# Altium schematic sheet Power_Sergeant.SchDoc
size Tabloid; SheetNumber: 3; SheetTotal: 6
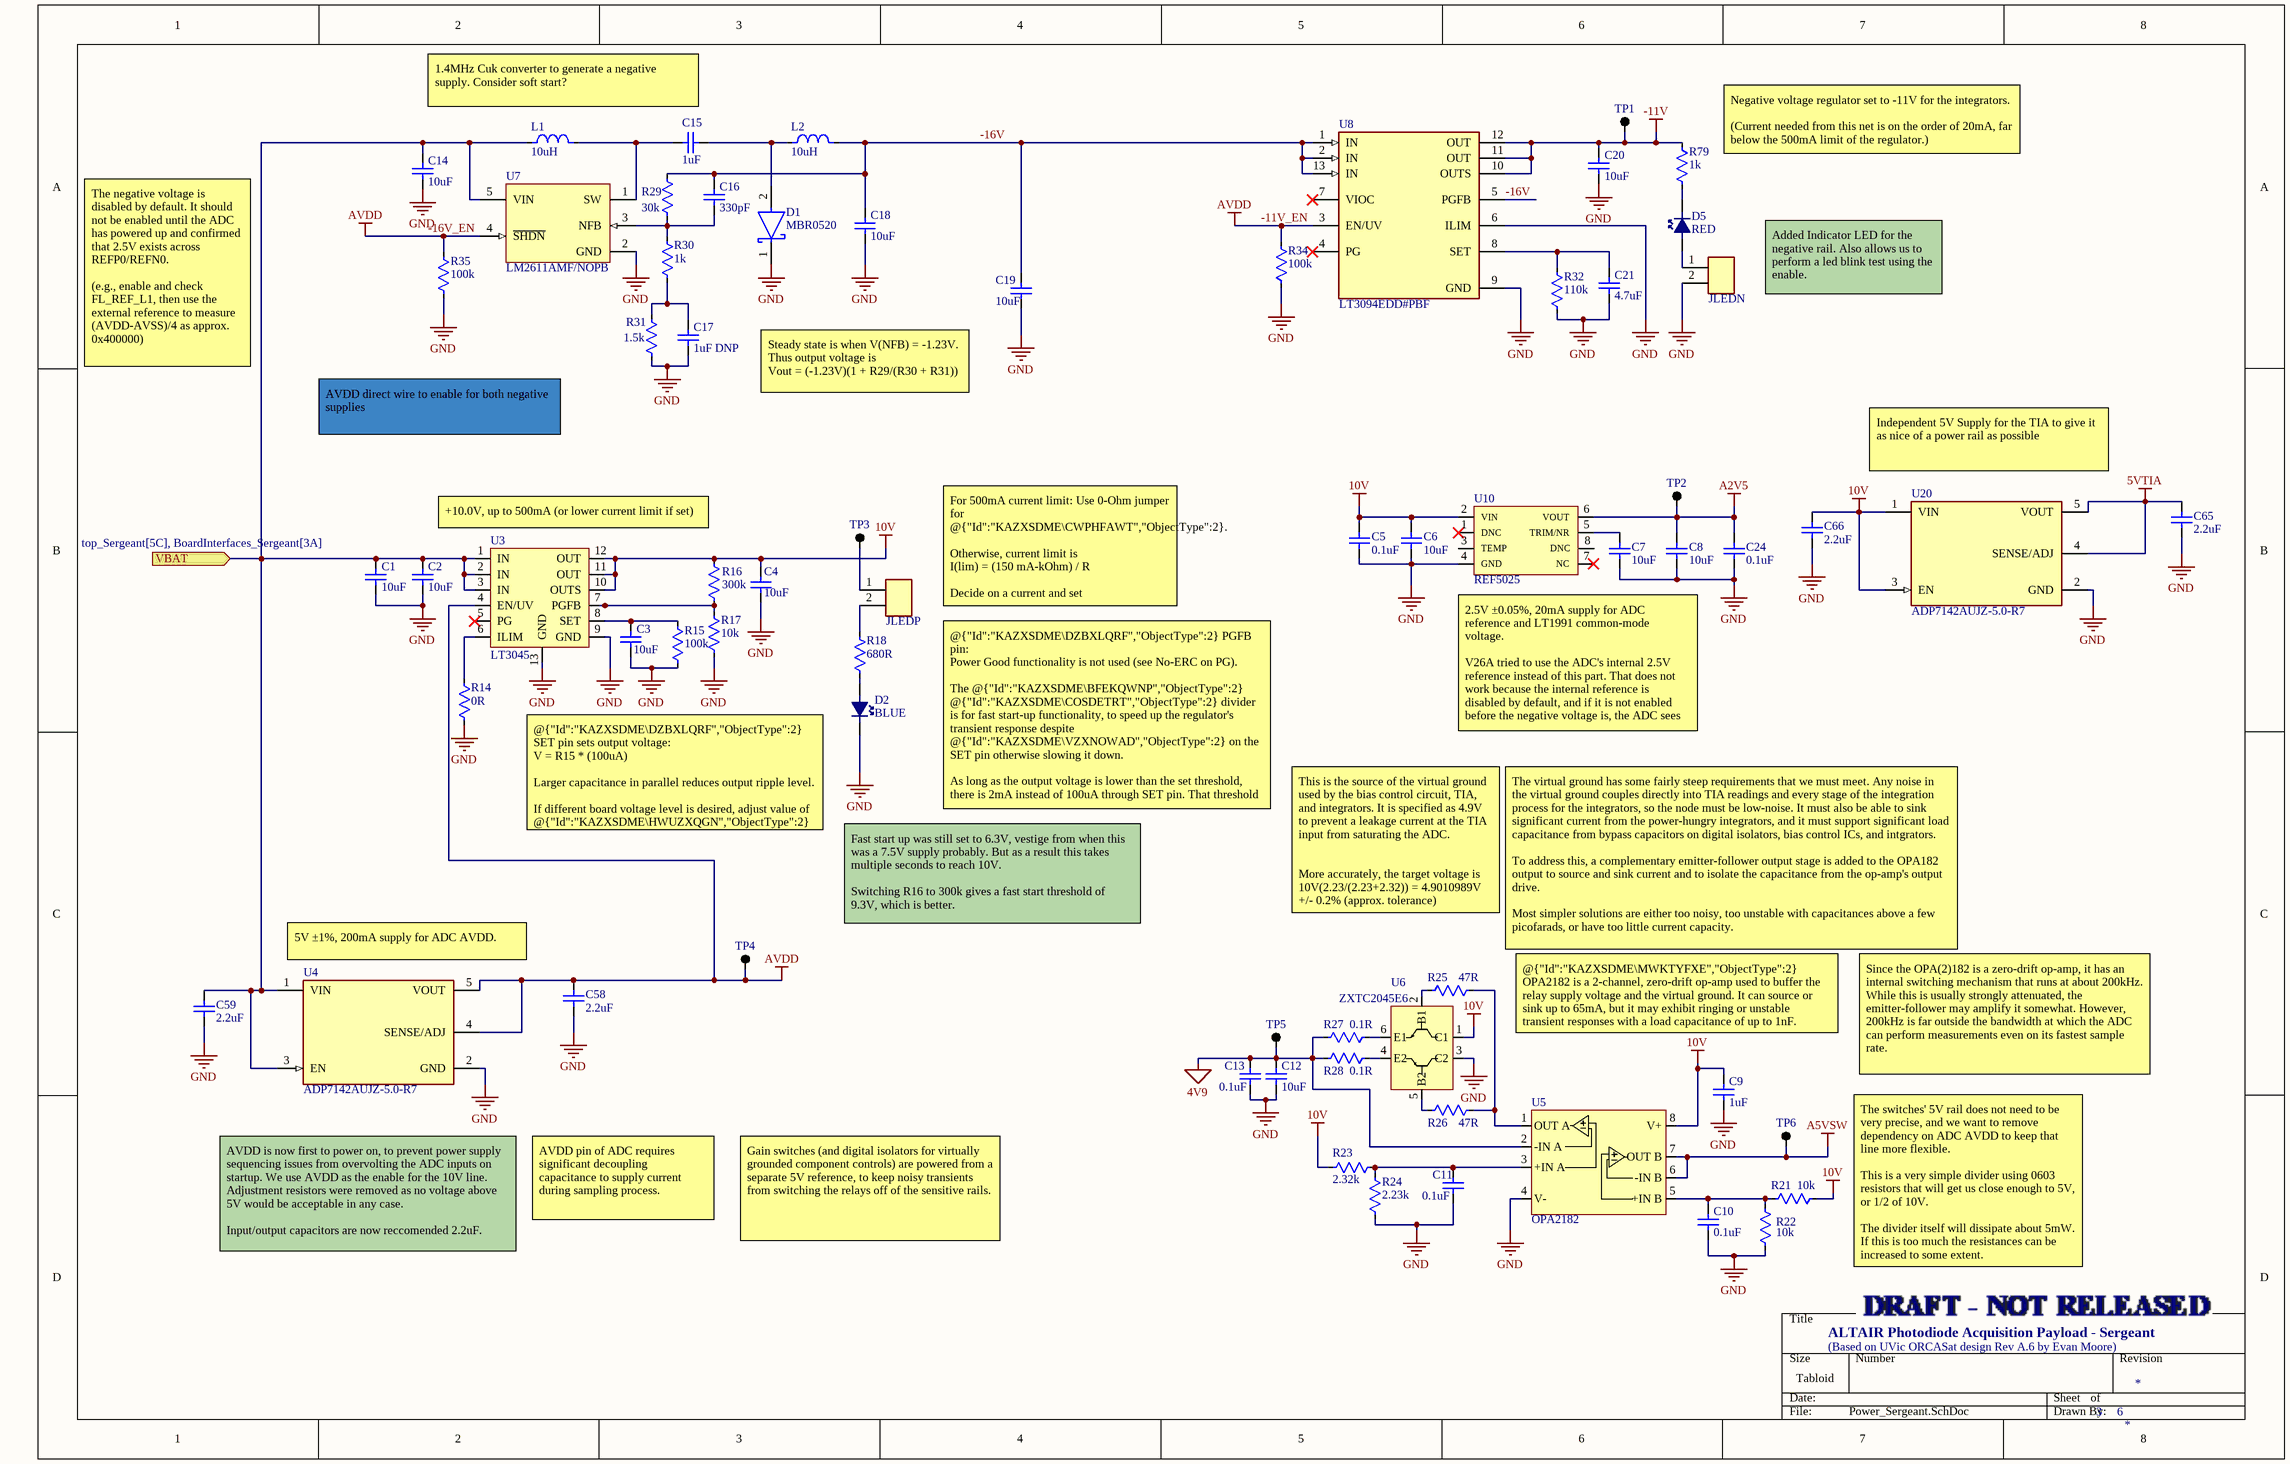
[diagram p0: Power_Sergeant.SchDoc]

## Parts
C1  10uF  [CAP 1206 IPC LOW DENSITY]
C2  10uF  [CAP 1206 IPC LOW DENSITY]
C3  10uF  [CAP 1206 IPC LOW DENSITY]
C4  10uF  [CAP 1206 IPC LOW DENSITY]
C5  0.1uF  [CAP 0603 IPC MID DENSITY]
C6  10uF  [CAP 0805 IPC MID DENSITY]
C7  10uF  [CAP 0805 IPC MID DENSITY]
C8  10uF  [CAP 0805 IPC MID DENSITY]
C9  1uF  [CAP 0603 IPC MID DENSITY]
C10  0.1uF  [CAP 0603 IPC MID DENSITY]
C11  0.1uF  [CAP 0603 IPC MID DENSITY]
C12  10uF  [CAP 1206 IPC LOW DENSITY]
C13  0.1uF  [CAP 0603 IPC MID DENSITY]
C14  10uF  [CAP 0805 IPC MID DENSITY]
C15  1uF  [CAP 0603 IPC MID DENSITY]
C16  330pF  [CAP 1206 NON-IPC KEMET NP0]
C17  1uF DNP  [CAP 0603 IPC MID DENSITY]
C18  10uF  [CAP 0805 IPC MID DENSITY]
C19  10uF  [CAP 0805 IPC MID DENSITY]
C20  10uF  [CAP 0805 IPC MID DENSITY]
C21  4.7uF  [CAP 0805 NON-IPC KEMET X5R]
C24  0.1uF  [CAP 0603 IPC MID DENSITY]
C58  2.2uF  [CAP 1206 UNKNOWN]
C59  2.2uF  [CAP 1206 UNKNOWN]
C65  2.2uF  [CAP 1206 UNKNOWN]
C66  2.2uF  [CAP 1206 UNKNOWN]
D1  MBR0520  [SOD-123 ONSEMI SMALL PADS]
D2  BLUE  [LED 0603 MID DENSITY]
D5  RED  [LED 0603 MID DENSITY]
JLEDN  JLED  [JUMPER 2POS 1MM PITCH THT]  (value not drawn)
JLEDP  JLED  [JUMPER 2POS 1MM PITCH THT]  (value not drawn)
L1  10uH  [IND VLS3012CX-1 NONSTANDARD TDK]
L2  10uH  [IND VLS3012CX-1 NONSTANDARD TDK]
R14  0R  [RES 0603 IPC MID DENSITY]
R15  100k  [RES 0603 IPC MID DENSITY]
R16  300k  [RES 0603 IPC MID DENSITY]
R17  10k  [RES 0603 IPC MID DENSITY]
R18  680R  [RES 0603 IPC MID DENSITY]
R21  10k  [RES 0603 IPC MID DENSITY]
R22  10k  [RES 0603 IPC MID DENSITY]
R23  2.32k  [RES 0603 IPC MID DENSITY]
R24  2.23k  [RES 0603 IPC MID DENSITY]
R25  47R  [RES 0402 NON-IPC SEI]
R26  47R  [RES 0402 NON-IPC SEI]
R27  0.1R  [RES 0402 NON-IPC YAGEO]
R28  0.1R  [RES 0402 NON-IPC YAGEO]
R29  30k  [RES 0805 IPC HIGH DENSITY]
R30  1k  [RES 0402 IPC LOW DENSITY YAGEO]
R31  1.5k  [RES 1206 NON-IPC VISHAY]
R32  110k  [RES 0603 IPC MID DENSITY]
R34  100k  [RES 0603 IPC MID DENSITY]
R35  100k  [RES 0603 IPC MID DENSITY]
R79  1k  [RES 0603 IPC MID DENSITY]
TP1  Testpoint  [TESTPOINT THT]  (value not drawn)  (no BOM)
TP2  Testpoint  [TESTPOINT THT]  (value not drawn)  (no BOM)
TP3  Testpoint  [TESTPOINT THT]  (value not drawn)  (no BOM)
TP4  Testpoint  [TESTPOINT THT]  (value not drawn)  (no BOM)
TP5  Testpoint  [TESTPOINT THT]  (value not drawn)  (no BOM)
TP6  Testpoint  [TESTPOINT THT]  (value not drawn)  (no BOM)
U3  LT3045  [12-TSOP 0.65MM PITCH 3MM WIDTH EP IPC MID DENSITY]
U4  ADP7142AUJZ-5.0-R7  [SOT23-5 HIGH DENSITY AD]
U5  OPA2182  [8-TSSOP 0.65MM PITCH 4.4MM WIDTH IPC MID DENSITY]
U6  ZXTC2045E6  [SOT23-6 NON-IPC DIODES]
U7  LM2611AMF/NOPB  [SOT23-5 MID DENSITY]
U8  LT3094EDD#PBF  [12DFN 3x3MM EP IPC MID DENSITY]
U10  REF5025  [8-TSOP 0.65MM PITCH 3MM WIDTH IPC MID DENSITY]
U20  ADP7142AUJZ-5.0-R7  [SOT23-5 HIGH DENSITY AD]

## Ports
VBAT (in, see top_Sergeant[5C], BoardInterfaces_Sergeant[3A])

## Nets
4V9: C12.2 C13.2 R27.1 R28.1 TP5.1 U5.2(-IN_A)
5VTIA: C65.1 U20.4(SENSE/ADJ) U20.5(VOUT)
10V: C4.2 C5.1 C6.2 C9.2 C66.1 JLEDP.1 R16.2 R21.2 R23.2 TP3.1 U3.10(OUTS) U3.11(OUT) U3.12(OUT) U5.8(V+) U6.1(C1) U10.2(VIN) U20.1(VIN) U20.3(EN)
-11V: C20.1 R79.2 TP1.1 U8.10(OUTS) U8.11(OUT) U8.12(OUT)
-11V_EN: C58.1 R34.1 R35.1 TP4.1 U3.4(EN/UV) U4.4(SENSE/ADJ) U4.5(VOUT) U7.4(~{SHDN}) U8.3(EN/UV)  [also labelled -16V_EN, AVDD]
A2V5: C8.2 C24.1 TP2.1 U10.6(VOUT)
A5VSW: TP6.1 U5.6(-IN_B) U5.7(OUT_B)
GND: C1.1 C2.1 C3.1 C4.1 C5.2 C6.1 C7.2 C8.1 C9.1 C10.1 C11.1 C12.1 C13.1 C14.1 C17.2 C18.2 C19.2 C20.2 C21.2 C24.2 C58.2 C59.2 C65.2 C66.2 D1.1(C) D2.1 JLEDN.2 R14.1 R15.1 R17.1 R22.1 R24.1 R31.1 R32.2 R34.2 R35.2 U3.9(GND) U3.13(GND) U4.2(GND) U5.4(V-) U6.3(C2) U7.2(GND) U8.6(ILIM) U8.9(GND) U10.4(GND) U20.2(GND)
-16V: C16.1 C18.1 C19.1 L2.2 R29.2 U8.1(IN) U8.2(IN) U8.5(PGFB) U8.13(IN)
VBAT: C1.2 C2.2 C14.2 C59.1 L1.1 U3.1(IN) U3.2(IN) U3.3(IN) U4.1(VIN) U4.3(EN) U7.5(VIN) ; port VBAT
NetC3_2: C3.2 R15.2 U3.8(SET)
NetC7_1: C7.1 U10.5(TRIM/NR)
NetC10_2: C10.2 R21.1 R22.2 U5.5(+IN_B)
NetC11_2: C11.2 R23.1 R24.2 U5.3(+IN_A)
NetC15_1: C15.1 L1.2 U7.1(SW)
NetC15_2: C15.2 D1.2(A) L2.1
NetC16_2: C16.2 R29.1 R30.2 U7.3(NFB)
NetC17_1: C17.1 R30.1 R31.2
NetC21_1: C21.1 R32.1 U8.8(SET)
NetD2_2: D2.2 R18.1
NetD5_1: D5.1 R79.1
NetD5_2: D5.2 JLEDN.1
NetJLEDP_2: JLEDP.2 R18.2
NetR14_2: R14.2 U3.6(ILIM)
NetR16_1: R16.1 R17.2 U3.7(PGFB)
NetR25_1: R25.1 U6.2(B1)
NetR25_2: R25.2 R26.2 U5.1(OUT_A)
NetR26_1: R26.1 U6.5(B2)
NetR27_2: R27.2 U6.6(E1)
NetR28_2: R28.2 U6.4(E2)

Not connected (* = marked no-connect by the designer): U3 5(PG)*; U8 4(PG)* 7(VIOC)*; U10 1(DNC)* 3(TEMP) 7(NC)* 8(DNC)

## Notes on the sheet
- 1.4MHz Cuk converter to generate a negative supply. Consider soft start?
- (near R79) Negative voltage regulator set to -11V for the integrators.
  (Current needed from this net is on the order of 20mA, far below the 500mA limit of the regulator.)
- Added Indicator LED for the negative rail. Also allows us to perform a led blink test using the enable.
- The negative voltage is disabled by default. It should not be enabled until the ADC has powered up and confirmed that 2.5V exists across REFP0/REFN0.
  (e.g., enable and check FL_REF_L1, then use the external reference to measure (AVDD-AVSS)/4 as approx. 0x400000)
- AVDD direct wire to enable for both negative supplies
- Steady state is when V(NFB) = -1.23V.
  Thus output voltage is
  Vout = (-1.23V)(1 + R29/(R30 + R31))
- (near U20) Independent 5V Supply for the TIA to give it as nice of a power rail as possible
- +10.0V, up to 500mA (or lower current limit if set)
- For 500mA current limit: Use 0-Ohm jumper for @{"Id":"KAZXSDME\CWPHFAWT","ObjectType":2}.
  Otherwise, current limit is
  I(lim) = (150 mA-kOhm) / R
  Decide on a current and set @{"Id":"KAZXSDME\CWPHFAWT","ObjectType":2} to the found value of R.
- 2.5V ±0.05%, 20mA supply for ADC reference and LT1991 common-mode voltage.
  V26A tried to use the ADC's internal 2.5V reference instead of this part. That does not work because the internal reference is disabled by default, and if it is not enabled before the negative voltage is, the ADC sees dangerously negative voltages on analog inputs.
- @{"Id":"KAZXSDME\DZBXLQRF","ObjectType":2} SET pin sets output voltage:
  V = R15 * (100uA)
  Larger capacitance in parallel reduces output ripple level.
  If different board voltage level is desired, adjust value of @{"Id":"KAZXSDME\HWUZXQGN","ObjectType":2} as necessary according to the above equation.
- @{"Id":"KAZXSDME\DZBXLQRF","ObjectType":2} PGFB pin:
  Power Good functionality is not used (see No-ERC on PG).
  The @{"Id":"KAZXSDME\BFEKQWNP","ObjectType":2} @{"Id":"KAZXSDME\COSDETRT","ObjectType":2} divider is for fast start-up functionality, to speed up the regulator's transient response despite @{"Id":"KAZXSDME\VZXNOWAD","ObjectType":2} on the SET pin otherwise slowing it down.
  As long as the output voltage is lower than the set threshold, there is 2mA instead of 100uA through SET pin. That threshold is
  V(PG) = (0.3V)(1 + R16/R17) - I(PGFB) R56
  Where I(PGFB) is on the order of 1E-8 A.
- (near U4) 5V ±1%, 200mA supply for ADC AVDD.
- Fast start up was still set to 6.3V, vestige from when this was a 7.5V supply probably. But as a result this takes multiple seconds to reach 10V.
  Switching R16 to 300k gives a fast start threshold of 9.3V, which is better.
- This is the source of the virtual ground used by the bias control circuit, TIA, and integrators. It is specified as 4.9V to prevent a leakage current at the TIA input from saturating the ADC.
  More accurately, the target voltage is 10V(2.23/(2.23+2.32)) = 4.9010989V +/- 0.2% (approx. tolerance)
- The virtual ground has some fairly steep requirements that we must meet. Any noise in the virtual ground couples directly into TIA readings and every stage of the integration process for the integrators, so the node must be low-noise. It must also be able to sink significant current from the power-hungry integrators, and it must support significant load capacitance from bypass capacitors on digital isolators, bias control ICs, and intgrators.
  To address this, a complementary emitter-follower output stage is added to the OPA182 output to source and sink current and to isolate the capacitance from the op-amp's output drive.
  Most simpler solutions are either too noisy, too unstable with capacitances above a few picofarads, or have too little current capacity.
- @{"Id":"KAZXSDME\MWKTYFXE","ObjectType":2} OPA2182 is a 2-channel, zero-drift op-amp used to buffer the relay supply voltage and the virtual ground. It can source or sink up to 65mA, but it may exhibit ringing or unstable transient responses with a load capacitance of up to 1nF.
- Since the OPA(2)182 is a zero-drift op-amp, it has an internal switching mechanism that runs at about 200kHz. While this is usually strongly attenuated, the emitter-follower may amplify it somewhat. However, 200kHz is far outside the bandwidth at which the ADC can perform measurements even on its fastest sample rate.
- AVDD pin of ADC requires significant decoupling capacitance to supply current during sampling process.
- AVDD is now first to power on, to prevent power supply sequencing issues from overvolting the ADC inputs on startup. We use AVDD as the enable for the 10V line. Adjustment resistors were removed as no voltage above 5V would be acceptable in any case.
  Input/output capacitors are now reccomended 2.2uF.
- Gain switches (and digital isolators for virtually grounded component controls) are powered from a separate 5V reference, to keep noisy transients from switching the relays off of the sensitive rails.
- (near R21) The switches' 5V rail does not need to be very precise, and we want to remove dependency on ADC AVDD to keep that line more flexible.
  This is a very simple divider using 0603 resistors that will get us close enough to 5V, or 1/2 of 10V.
  The divider itself will dissipate about 5mW. If this is too much the resistances can be increased to some extent.
- ALTAIR Photodiode Acquisition Payload - Sergeant
- (Based on UVic ORCASat design Rev A.6 by Evan Moore)

## Library data of the parts
C1-C4 C12 = CAP: Murata GRT319R6YA106KE01D - Cap Ceramic 10uF 35V X5R 10% Pad SMD 1206 85C Automotive T/R; MF: Murata; MP: GRT319R6YA106KE01D
C5 C10 C11 C13 C24 = CAP: Kemet C0603C104K5RACAUTO - Cap Ceramic 0.1uF 50V X7R 10% 0603 125C Paper T/R; MF: Kemet; MP: C0603C104K5RACAUTO
C6-C8 C14 C18-C20 = CAP: Murata GRM21BR61E106KA73L - Cap Ceramic 10uF 10% 25V X5R 0805; MF: Murata; MP: GRM21BR61E106KA73L
C9 C15 C17 = CAP: Murata GRT188R61H105KE13D - Cap MLCC AEC-Q200 X5R 1uF 50V 0603; MF: Murata; MP: GRT188R61H105KE13D
C16 = CAP: Kemet C1206C331J5GACTU - Cap Ceramic 330pF 50V 5% NP0 1206; MF: Kemet; MP: C1206C331J5GACTU
C21 = CAP: Kemet C0805C475K8PACTU - Cap Ceramic 4.7uF 10V X5R 0805; MF: Kemet; MP: C0805C475K8PACTU
C58 C59 C65 C66 = CAP: CL31B225KBHNNNE CAP CER 2.2UF 50V X7R 1206; MF: Samsung Electro-Mechanics; MP: CL31B225KBHNNNE
D1 = Schottky: DIODE SCHOTTKY 20V 500MA SOD123; Polarity: Standard; Peak Non-Repetitive Surge Current: 5.5A; Forward Voltage: 385mV; Element Configuration: Single; Peak Reverse Current: 250uA; MF: onsemi; MP: MBR0520LT1G; Max Repetitive Reverse Voltage (Vrrm): 20V; Voltage Rating (DC): 20V; Case/Package: SOD-123-2; Number of Pins: 2; Output Current: 500mA; Min Operating Temperature: -65°C; Lead Free: Lead Free; REACH SVHC: No SVHC; Max Reverse Voltage (DC): 20V; Termination: SMD/SMT; Average Rectified Current: 500mA; Max Surge Current: 5.5A; Package Quantity: 3000; Height: 1.12mm; Current Rating: 500mA; Forward Current: 500mA; Max Forward Surge Current (Ifsm): 5.5A; Packaging: Tape and Reel; Length: 2.69mm; Radiation Hardening: No; Max Reverse Leakage Current: 250uA; Width: 1.6mm; Contact Plating: Tin; Max Operating Temperature: 125°C
D2 = LED-blue: LED BLUE CLEAR 0603 SMD; Luminous Intensity: 145mcd; Forward Current: 30mA; Forward Voltage: 3.2V; Wavelength: 470nm; Viewing Angle: 140°; Lens Style: Clear,Rectangular; Test Current: 20mA; MF: Wurth Electronics; MP: 150060BS75000; RoHS: Yes; Category: LEDs; Stock 1: 66561; Mount: Surface Mount; Case/Package: 0603; Color: Blue; Case Code (Metric): 1608; Case Code (Imperial): 0603; Min Operating Temperature: -40°C; Max Operating Temperature: 85°C; Package Quantity: 4000; Packaging: Cut Tape; Dominant Wavelength: 470nm; Length: 1.6mm; Height: 0.7mm; Width: 0.8mm; REACH SVHC: Unknown; ComponentLink1URL: https://datasheet.ciiva.com/29563/150060bs75000-29563034.pdf?src-supplier=Digi-Key; ComponentLink1Description: https://datasheet.ciiva.com/29563/150060bs75000-29563034.pdf?src-supplier=Digi-Key; ComponentLink2URL: https://datasheet.ciiva.com/29279/759426-da-01-en-chipled-0603-w-kl-blau-150060bs75000-29279193.pdf?src-supplier=Conrad; ComponentLink2Description: https://datasheet.ciiva.com/29279/759426-da-01-en-chipled-0603-w-kl-blau-150060bs75000-29279193.pdf?src-supplier=Conrad; ComponentLink3URL: https://datasheet.ciiva.com/29563/150060bs75000-29563035.pdf?src-supplier=Digi-Key; ComponentLink3Description: https://datasheet.ciiva.com/29563/150060bs75000-29563035.pdf?src-supplier=Digi-Key; ComponentLink4URL: https://datasheet.ciiva.com/29563/150060bs75000-29563036.pdf?src-supplier=Digi-Key; ComponentLink4Description: https://datasheet.ciiva.com/29563/150060bs75000-29563036.pdf?src-supplier=Digi-Key; ComponentLink5URL: https://datasheet.ciiva.com/22656/1911343-22656939.pdf?src-supplier=Element14; ComponentLink5Description: https://datasheet.ciiva.com/22656/1911343-22656939.pdf?src-supplier=Element14; ComponentLink6URL: https://datasheet.ciiva.com/48430/150060bs75000-eng-tds-48430039.pdf?src-supplier=Distrelec; ComponentLink6Description: https://datasheet.ciiva.com/48430/150060bs75000-eng-tds-48430039.pdf?src-supplier=Distrelec; Supplier 1: Digi-Key; Supplier Part Number 1: 732-4966-1-ND
D5 = LED-blue: LED RED CLEAR 0603 SMD; Color: Blue; Luminous Intensity: 145mcd; Forward Current: 30mA; Forward Voltage: 3.2V; Wavelength: 470nm; Viewing Angle: 140°; Lens Style: Clear,Rectangular; Test Current: 20mA; MF: Wurth Electronics; MP: 150060RS75000; RoHS: Yes; Category: LEDs; Stock 1: 66561; Mount: Surface Mount; Case/Package: 0603; Case Code (Metric): 1608; Case Code (Imperial): 0603; Min Operating Temperature: -40°C; Max Operating Temperature: 85°C; Package Quantity: 4000; Packaging: Cut Tape; Dominant Wavelength: 470nm; Length: 1.6mm; Height: 0.7mm; Width: 0.8mm; REACH SVHC: Unknown; ComponentLink1URL: https://datasheet.ciiva.com/29563/150060bs75000-29563034.pdf?src-supplier=Digi-Key; ComponentLink1Description: https://datasheet.ciiva.com/29563/150060bs75000-29563034.pdf?src-supplier=Digi-Key; ComponentLink2URL: https://datasheet.ciiva.com/29279/759426-da-01-en-chipled-0603-w-kl-blau-150060bs75000-29279193.pdf?src-supplier=Conrad; ComponentLink2Description: https://datasheet.ciiva.com/29279/759426-da-01-en-chipled-0603-w-kl-blau-150060bs75000-29279193.pdf?src-supplier=Conrad; ComponentLink3URL: https://datasheet.ciiva.com/29563/150060bs75000-29563035.pdf?src-supplier=Digi-Key; ComponentLink3Description: https://datasheet.ciiva.com/29563/150060bs75000-29563035.pdf?src-supplier=Digi-Key; ComponentLink4URL: https://datasheet.ciiva.com/29563/150060bs75000-29563036.pdf?src-supplier=Digi-Key; ComponentLink4Description: https://datasheet.ciiva.com/29563/150060bs75000-29563036.pdf?src-supplier=Digi-Key; ComponentLink5URL: https://datasheet.ciiva.com/22656/1911343-22656939.pdf?src-supplier=Element14; ComponentLink5Description: https://datasheet.ciiva.com/22656/1911343-22656939.pdf?src-supplier=Element14; ComponentLink6URL: https://datasheet.ciiva.com/48430/150060bs75000-eng-tds-48430039.pdf?src-supplier=Distrelec; ComponentLink6Description: https://datasheet.ciiva.com/48430/150060bs75000-eng-tds-48430039.pdf?src-supplier=Distrelec; Supplier 1: Digi-Key; Supplier Part Number 1: 732-4966-1-ND
JLEDN JLEDP = BC020-02-A-0200-0300-L-G: 2x1 Header THT 1mm Pitch; MF: GCT (GLOBAL CONNECTOR TECHNOLOGY); Datasheet Link: https://gct.co/connector/bc020; MP: BC020-02-A-0200-0300-L-G; Mouser Part Number: 640-BC02002A02300LG; Mouser Price/Stock: https://www.mouser.co.uk/ProductDetail/GCT/BC020-02-A-0200-0300-L-G?qs=KUoIvG%2F9IlakgsojlT9P9w%3D%3D
L1 L2 = IND: TDK VLS3012CX-100M-1 - Inductor 10uH 20% 1.25A 0.324Ohm NonstandardPkg; DC Resistance (DCR): 324mR; Core Material: Ferrite; Saturation Current: 1A; Test Frequency: 100kHz; MF: TDK Corporation; Inductance: 10uH; Height: 1.20mm; Width: 3.00mm; Inductance Tolerance: 20%; Lead Free: Lead Free; Length: 3.00mm; Max Operating Temperature: 105°C; Resistor Type: Wirewound; Height - Seated (Max): 0.047inch; Series: VLS-CX-1; Packaging: Tape and Reel; Number of Pins: 2; Tolerance: 20%; Mount: Surface Mount; Max DC Current: 1.25A; Min Operating Temperature: -40°C; Termination: SMD/SMT; MP: VLS3012CX-100M-1
R14 = RES: Vishay CRCW06030000Z0EA - Res 0 Ohms 1/8W SMD 0603; MF: Vishay Dale; MP: CRCW06030000Z0EA
R15 = RES: Panasonic ERA-3ARB104V - Res SMD 0603 0.1% 0.10W T.C. 10ppm 100K; MF: Panasonic Electronic Components; MP: ERA-3ARB104V
R16 = RES: Vishay MCT06030C3003FP500 - Res SMD 300kOhm 1% 1/10W 0603; MF: Vishay Dale; MP: MCT06030C3003FP500
R17 R21 R22 = RES: Vishay CRCW060310K0FKEA SMD 0603 10k, CRCW e3 Series, 75V, thick film, 100mW; MF: Vishay Dale; MP: CRCW060310K0FKEA
R18 = RES: Panasonic ERJ-3EKF6800V - Res SMD 680 Ohm 1% 1/10W 0603; MF: Panasonic Electronic Components; MP: ERJ-3EKF6800V
R23 = RES: Vishay TNPW06032K32BEEA - Res 2.32k 0.1% 0.21W SMD 0603; MF: Vishay Dale; MP: TNPW06032K32BEEA
R24 = RES: KOA Speer RN73R1JTTD2231B25 - Res 2.23k 0.1% 1/10W SMD 0603; MF: KOA Speer Electronics, Inc.; MP: RN73R1JTTD2231B25
R25 R26 = RES: Stackpole RMCF0402JT47R0 - Res 47Ohm 5% 0.063W 0402 Thick Film AEC-Q200 compliant; MF: Stackpole Electronics Inc.; MP: RMCF0402JT47R0
R27 R28 = RES: Yageo RL0402JR-070R1L - Res 0.1Ohm 5% 1/16W SMD 0402; MF: YAGEO; MP: RL0402JR-070R1L
R29 = RES: Panasonic ERA-6AEB303V - Res 30kOhm 0.1% 1/8W 0805; MF: Panasonic Electronic Components; MP: ERA-6AEB303V
R30 = RES: Yageo RC0402FR-071KL - Res 1kOhm 1% 1/16W 0402; MF: YAGEO; MP: RC0402FR-071KL
R31 = RES: Vishay TNPU12061K50BZEN00 - Res 1.5kOhm 0.1% 1/4W 1206; MF: Vishay Dale; MP: TNPU12061K50BZEN00
R32 = RES: Panasonic ERA-3AEB114V - Res 110k 0.1% 1/10W SMD 0603; MF: Panasonic Electronic Components; MP: ERA-3AEB114V
R34 R35 = RES: Panasonic ERJ-3GEYJ104V - Res 100k 5% 1/10W SMD 0603; MF: Panasonic Electronic Components; MP: ERJ-3GEYJ104V
R79 = RES: Panasonic ERJ-U03F1001V - Res SMD 1 kOhm 1% 1/10W 0603; MF: Panasonic Electronic Components; MP: ERJ-U03F1001V
U3 = LT3045: 20V 500mA Ultralow Noise Ultrahigh PSRR Adjustable Linear Regulator 260V Dropout MSOP-12; Output Voltage: 15V; Dropout Voltage: 260mV; Number of Regulators: 1; Min Current Limit: 570mA; MF: Analog Devices / Linear Technology; MP: LT3045EMSE#PBF; RoHS: Yes; Stock 1: 1588; Case/Package: MSOP; Min Operating Temperature: -40°C; Max Operating Temperature: 125°C; Output Current: 500mA; ComponentLink1URL: http://www.farnell.com/datasheets/2163219.pdf?src-supplier=Farnell; ComponentLink1Description: http://www.farnell.com/datasheets/2163219.pdf?src-supplier=Farnell; ComponentLink2URL: http://www.linear.com/docs/55649?src-supplier=Digi-Key; ComponentLink2Description: http://www.linear.com/docs/55649?src-supplier=Digi-Key; Supplier 1: Digi-Key; Supplier Part Number 1: LT3045EMSE#PBF-ND
U4 U20 = ADP7142AUJZ-R7: 1.2-40V 200mA Low Noise CMOS LDO Adjustable Linear Regulator TSOT23; Nominal Supply Current: 50-180uA; Output Type: AdjustableProgrammable; Max Supply Voltage: 40V; Number Of Outputs: 1; Dropout Voltage: 200mV; Output Voltage: 1.2-5V; Min Supply Voltage: 2.7V; Max Junction Temp: +150°C; MF: Analog Devices; Accuracy Percentage: 0.8%; Ambient Temperature Range Low: -40°C; ComponentLink2Description: Datasheet; Digikey Description: IC REG LIN POS ADJ 200MA TSOT23; Device Class L1: Integrated Circuits (ICs); Mouser Description: LDO Regulator Pos 1.5V to 5V 0.2A 5-Pin TSOT-23 T/R; Height: 1mm; Temperature Range Low: -40°C; Output Current: 200mA; Device Class L3: Voltage Regulators - Linear; Octopart: https://octopart.com/adp7142aujz-r7-analog+devices-38928114; Category: IC; MP: ADP7142AUJZ-5.0-R7; ComponentLink2URL: https://www.analog.com/media/en/technical-documentation/data-sheets/ADP7142.pdf; Device Class L2: Power Management ICs; Package: UJ-5; Automotive: No; Lead Free: Yes; Ambient Temperature Range High: +125°C; Temperature: -40°C to +125°C; Temperature Range High: +125°C; RoHS: TRUE; Manufacturer: Analog Devices; Manufacturer Part Number: ADP7142AUJZ-R7
U5 = OPA2182IDBV: Op amp, 2 Channel, Highest-precision, 36-V, 5-MHz, single, low-noise, zero-drift, MUX-friendly amplifier 8VSSOP -40 to 125; MF: Texas Instruments; MP: OPA2182IDGKR
U6 = ZXTC2045E6: BJT Array, 1NPN 1PNP, VCE(sat) 375mV, hFE 300, Breakdown 30V, 6-SOT-23; MF: Diodes Incorporated; MP: ZXTC2045E6TA
U7 = LM2611AMF: 1.4MHz Cuk Converter, 5-pin SOT-23, Pb-Free; PowerWise: N; CompType: Switcher; PackageTopMarking: S40A*XTT; MF: Texas Instruments; ComponentLink1URL: http://www.ti.com/general/docs/lit/getliterature.tsp?genericPartNumber=LM2611&fileType=pdf; PackageDescription: Molded SOT-23, .115 x .063 x .040 in Body, 5 Lead, .0375 in Pitch; ComponentLink1Description: Datasheet URL; PackageReference: DBV0005A; PinCount: 5; RoHS: Y; MP: LM2611AMF/NOPB
U8 = LT3094EDD#PBF: -20V 500mA Ultralow Noise Ultrahigh PSRR Adjustable Negative Linear Regulator 12DFN; MF: Analog Devices; RoHS Compliant: Yes; MP: LT3094EDD#PBF
U10 = REF5050IDGKR: 2.5V±0.05% Voltage Reference 8VSSOP; MF: Texas Instruments; MP: REF5025IDGKR; Number of Channels: 1; Max Input Voltage: 18V; Output Voltage: 5V; Min Input Voltage: 5.2V; Nominal Supply Current: 800uA; Tolerance: 0.05%; Max Output Current: 10mA; Operating Supply Current: 1.2mA; Temperature Coefficient: 3ppm/°C; Reference Type: Series; Output Type: Fixed; Supplier 1: Digi-Key; RoHS: Yes; Category: Voltage References; Stock 1: 2539; Pricing 1: 1=6.18000, 10=5.58100, 25=5.32200, 100=4.41320, 250=4.02380, 500=3.76420, 1000=3.45268 (USD); Case/Package: VSSOP; Number of Pins: 8; Weight: 0.00067oz; Min Operating Temperature: -40°C; Max Operating Temperature: 125°C; Packaging: Tape and Reel; Package Quantity: 1; Min Output Voltage: 5V; Output Current: 10mA; Max Output Voltage: 5V; Quiescent Current: 800uA; Radiation Hardening: No; Lead Free: Lead Free; ComponentLink1URL: https://datasheet.ciiva.com/2007/ref5020-2007532.pdf?src-supplier=Digi-Key; ComponentLink1Description: https://datasheet.ciiva.com/2007/ref5020-2007532.pdf?src-supplier=Digi-Key; ComponentLink2URL: https://datasheet.ciiva.com/14197/ref5050-14197084.pdf?src-supplier=Avnet; ComponentLink2Description: https://datasheet.ciiva.com/14197/ref5050-14197084.pdf?src-supplier=Avnet; ComponentLink3URL: https://datasheet.ciiva.com/2007/ref5020-2007533.pdf?src-supplier=Digi-Key; ComponentLink3Description: https://datasheet.ciiva.com/2007/ref5020-2007533.pdf?src-supplier=Digi-Key; ComponentLink4URL: https://datasheet.ciiva.com/2007/ref5020-2007534.pdf?src-supplier=Digi-Key; ComponentLink4Description: https://datasheet.ciiva.com/2007/ref5020-2007534.pdf?src-supplier=Digi-Key; ComponentLink5URL: https://datasheet.ciiva.com/41462/001014471-da-01-en-ic-vref-series-ref5050idgkr-vssop-8-tid-41462326.pdf?src-supplier=Conrad; ComponentLink5Description: https://datasheet.ciiva.com/41462/001014471-da-01-en-ic-vref-series-ref5050idgkr-vssop-8-tid-41462326.pdf?src-supplier=Conrad; Supplier Part Number 1: 296-27505-1-ND